# Altium schematic sheet FrontPanel.SchDoc: Front Panel
size 420 x 297 mm; CheckedBy: T.Janicki; CompanyName: Creotech Instruments SA; DrawnBy: G.Kasprowicz; Organization: CERN; Address1: European Organization for Nuclear Research; Address2: CH-1211 Genève 23 - Switzerland; Revision: -; SheetNumber: 9; SheetTotal: 15; EDA_Number: EDA-xxxx; Projet: Simple VME FMC Carrier; ModifiedBy: -; CreateDate: 20/11/2012; CheckedDate: 23/01/2012; DivGrp: BE-CO; Designer: G.Kasprowicz; PageSetup: Record=PageOptions|CenterHorizontal=True|CenterVertical=True|PrintScale=0.67|XCorrection=1.00|YCorrection=1.00|PrintKind=1|BorderSize=5000000|LeftOffset=0|BottomOffset=0|Orientation=2|PaperLength=1000|PaperWidth=1000|Scale=100|PaperSource=15|PrintQuality=600|MediaType=1|DitherType=10|PaperKind=A3|PrintScaleMode=1; ModifiedDate: -
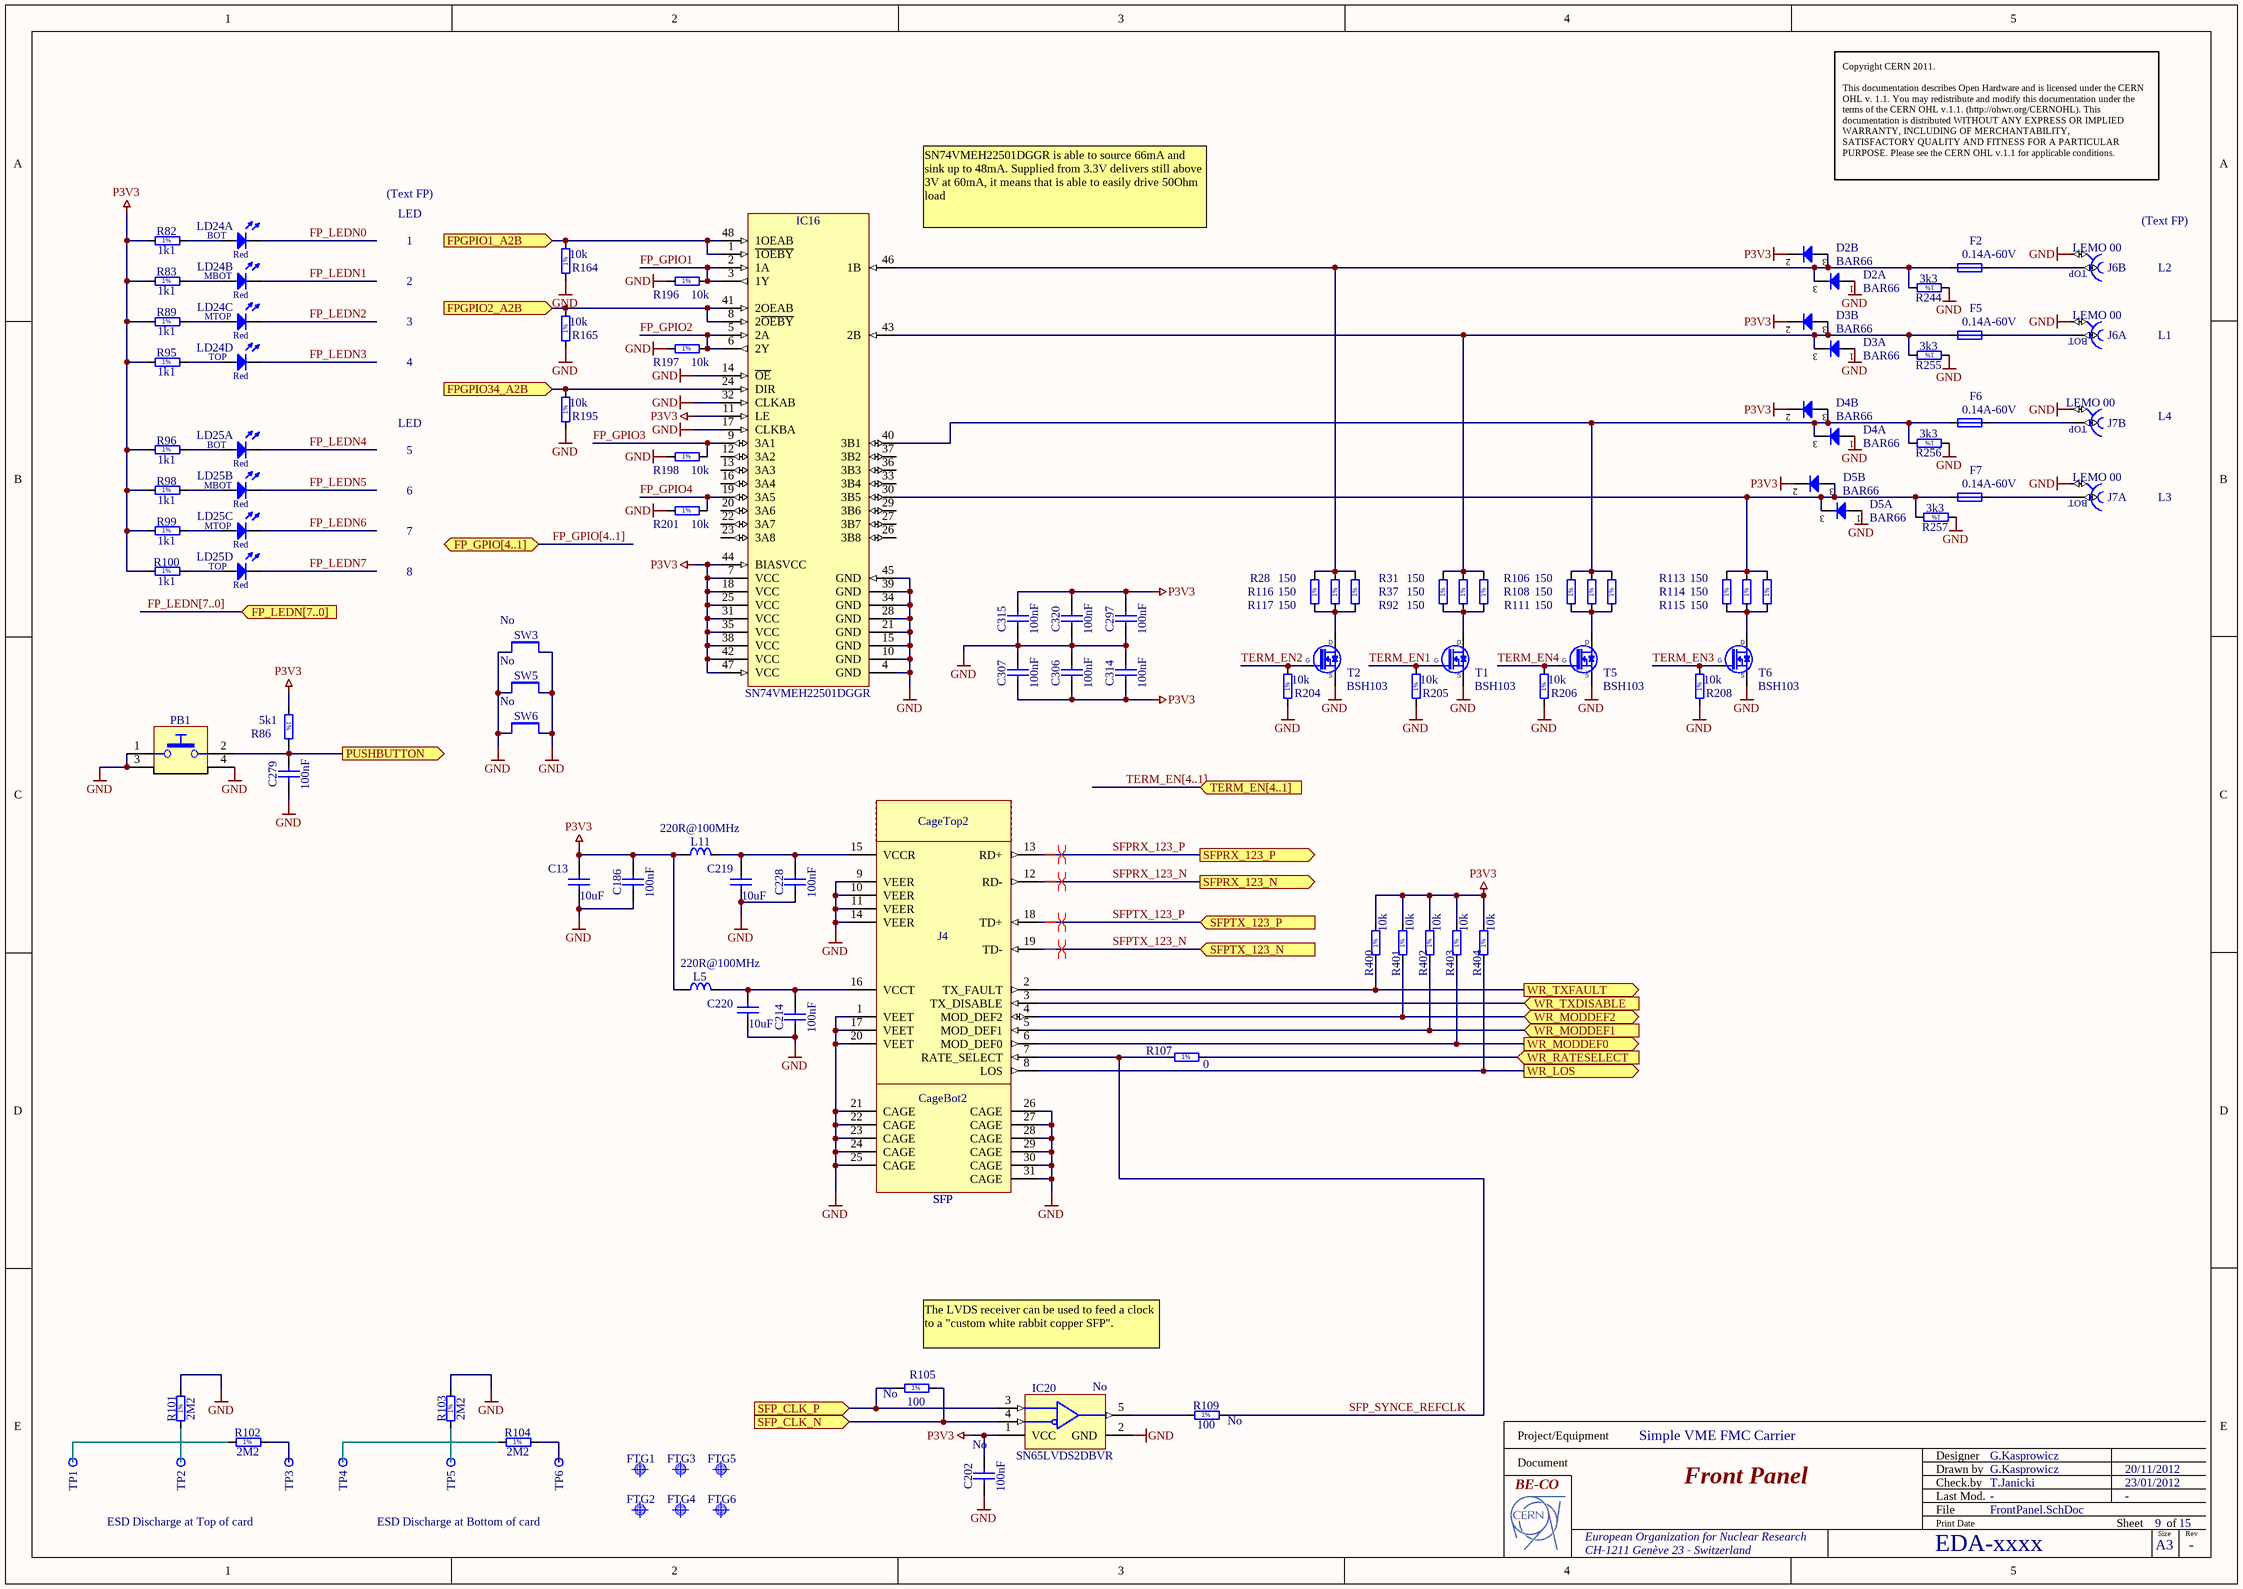
[diagram p0: FrontPanel.SchDoc]

## Parts
C13  10uF  [CAPC3225X270N]
C186  100nF  [CAPC1005X55N]
C202  100nF  Mounted: No  [CAPC1005X55N]
C214  100nF  [CAPC1005X55N]
C219  10uF  [CAPC3225X270N]
C220  10uF  [CAPC3225X270N]
C228  100nF  [CAPC1005X55N]
C279  100nF  [CAPC1005X55N]
C297  100nF  [CAPC1005X55N]
C306  100nF  [CAPC1005X55N]
C307  100nF  [CAPC1005X55N]
C314  100nF  [CAPC1005X55N]
C315  100nF  [CAPC1005X55N]
C320  100nF  [CAPC1005X55N]
CageBot2  SFP  [TYCO_6367034-1]
CageTop2  SFP  [TYCO_6367035-1]
D2  BAR66  [SOT95P240X110-3N]  (parts A,B of 2)
D3  BAR66  [SOT95P240X110-3N]  (parts A,B of 2)
D4  BAR66  [SOT95P240X110-3N]  (parts A,B of 2)
D5  BAR66  [SOT95P240X110-3N]  (parts A,B of 2)
F2  0.14A-60V  [FUSRC4632X90N]
F5  0.14A-60V  [FUSRC4632X90N]
F6  0.14A-60V  [FUSRC4632X90N]
F7  0.14A-60V  [FUSRC4632X90N]
FTG1  Use only in PCB  [FIDUCIAL_TOP_S100-200]  (value not drawn)
FTG2  Use only in PCB  [FIDUCIAL_TOP_S100-200]  (value not drawn)
FTG3  Use only in PCB  [FIDUCIAL_TOP_S100-200]  (value not drawn)
FTG4  Use only in PCB  [FIDUCIAL_TOP_S100-200]  (value not drawn)
FTG5  Use only in PCB  [FIDUCIAL_TOP_S100-200]  (value not drawn)
FTG6  Use only in PCB  [FIDUCIAL_TOP_S100-200]  (value not drawn)
IC16  SN74VMEH22501DGGR  [SOP50P810X120-48N]
IC20  SN65LVDS2DBVR  Mounted: No  [SOT95P280X145-5N]
J4  SFP  [TYCO_1367073-1]
J6  LEMO 00  [LEMO_EPY.00.250.NTNY]  (parts A,B of 2)
J7  LEMO 00  [LEMO_EPY.00.250.NTNY]  (parts A,B of 2)
L5  220R@100MHz  [INDC2012X105N]
L11  220R@100MHz  [INDC2012X105N]
LD24  HE Red  [LED_BIVAR_H485CHDL]  (value not drawn)  (parts A,B,C,D of 4)
LD25  HE Red  [LED_BIVAR_H485CHDL]  (value not drawn)  (parts A,B,C,D of 4)
PB1  Push Button  [PB_ALPS_SKHHLQA010]  (value not drawn)
R28  150  [RESC3216X65N]
R31  150  [RESC3216X65N]
R37  150  [RESC3216X65N]
R82  1k1  [RESC1608X55N]
R83  1k1  [RESC1608X55N]
R86  5k1  [RESC1608X55N]
R89  1k1  [RESC1608X55N]
R92  150  [RESC3216X65N]
R95  1k1  [RESC1608X55N]
R96  1k1  [RESC1608X55N]
R98  1k1  [RESC1608X55N]
R99  1k1  [RESC1608X55N]
R100  1k1  [RESC1608X55N]
R101  2M2  [RESC2012X60N]
R102  2M2  [RESC2012X60N]
R103  2M2  [RESC2012X60N]
R104  2M2  [RESC2012X60N]
R105  100  Mounted: No  [RESC1608X55N]
R106  150  [RESC3216X65N]
R107  0  [RESC1608X55N]
R108  150  [RESC3216X65N]
R109  100  Mounted: No  [RESC1608X55N]
R111  150  [RESC3216X65N]
R113  150  [RESC3216X65N]
R114  150  [RESC3216X65N]
R115  150  [RESC3216X65N]
R116  150  [RESC3216X65N]
R117  150  [RESC3216X65N]
R164  10k  [RESC1608X55N]
R165  10k  [RESC1608X55N]
R195  10k  [RESC1608X55N]
R196  10k  [RESC1608X55N]
R197  10k  [RESC1608X55N]
R198  10k  [RESC1608X55N]
R201  10k  [RESC1608X55N]
R204  10k  [RESC1608X55N]
R205  10k  [RESC1608X55N]
R206  10k  [RESC1608X55N]
R208  10k  [RESC1608X55N]
R244  3k3  [RESC1608X55N]
R255  3k3  [RESC1608X55N]
R256  3k3  [RESC1608X55N]
R257  3k3  [RESC1608X55N]
R400  10k  [RESC1608X55N]
R401  10k  [RESC1608X55N]
R402  10k  [RESC1608X55N]
R403  10k  [RESC1608X55N]
R404  10k  [RESC1608X55N]
SW3  Mounted: No  [COMATEL_313.0004.0.00.500]  (hidden comment: Jumper Type2)
SW5  Mounted: No  [COMATEL_313.0004.0.00.500]  (hidden comment: Jumper Type2)
SW6  Mounted: No  [COMATEL_313.0004.0.00.500]  (hidden comment: Jumper Type2)
T1  BSH103  [SOT95P230X110-3N]
T2  BSH103  [SOT95P230X110-3N]
T5  BSH103  [SOT95P230X110-3N]
T6  BSH103  [SOT95P230X110-3N]
TP1  Test Point  [TPS127]  (value not drawn)
TP2  Test Point  [TPS127]  (value not drawn)
TP3  Test Point  [TPS127]  (value not drawn)
TP4  Test Point  [TPS127]  (value not drawn)
TP5  Test Point  [TPS127]  (value not drawn)
TP6  Test Point  [TPS127]  (value not drawn)

## Ports
FP_GPIO[4..1] (bidir), FP_LEDN[7..0] (in), FPGPIO1_A2B (in), FPGPIO2_A2B (in), FPGPIO34_A2B (in), PUSHBUTTON (out), SFP_CLK_N (in), SFP_CLK_P (in), SFPRX_123_N (out), SFPRX_123_P (out), SFPTX_123_N (in), SFPTX_123_P (in), TERM_EN[4..1] (in), WR_LOS (out), WR_MODDEF0 (out), WR_MODDEF1 (in), WR_MODDEF2 (bidir), WR_RATESELECT (in), WR_TXDISABLE (in), WR_TXFAULT (out)

## Nets
GND: C13.2 C186.2 C202.1 C214.2 C219.2 C220.2 C228.2 C279.1 C297.1 C306.2 C307.2 C314.2 C315.1 C320.1 CageBot2.21(CAGE) CageBot2.22(CAGE) CageBot2.23(CAGE) CageBot2.24(CAGE) CageBot2.25(CAGE) CageBot2.26(CAGE) CageBot2.27(CAGE) CageBot2.28(CAGE) CageBot2.29(CAGE) CageBot2.30(CAGE) CageBot2.31(CAGE) D2.1(A) D3.1(A) D4.1(A) D5.1(A) IC16.4(GND) IC16.10(GND) IC16.14(~{OE}) IC16.15(GND) IC16.17(CLKBA) IC16.21(GND) IC16.28(GND) IC16.32(CLKAB) IC16.34(GND) IC16.39(GND) IC16.45(GND) IC20.2(GND) J4.1(VEET) J4.9(VEER) J4.10(VEER) J4.11(VEER) J4.14(VEER) J4.17(VEET) J4.20(VEET) J6.3 J7.3 PB1.1 PB1.3 PB1.4 R101.2 R103.2 R164.1 R165.1 R195.1 R196.1 R197.1 R198.1 R201.1 R204.1 R205.1 R206.1 R208.1 R244.1 R255.1 R256.1 R257.1 SW3.1 SW3.2 SW5.1 SW5.2 SW6.1 SW6.2 T1.2(S) T2.2(S) T5.2(S) T6.2(S)
P3V3: C13.1 C186.1 C202.2 C297.2 C306.1 C307.1 C314.1 C315.2 C320.2 D2.2(C) D3.2(C) D4.2(C) D5.2(C) IC16.7(VCC) IC16.11(LE) IC16.18(VCC) IC16.25(VCC) IC16.31(VCC) IC16.35(VCC) IC16.38(VCC) IC16.42(VCC) IC16.44(BIASVCC) IC16.47(VCC) IC20.1(VCC) L5.1 L11.1 R82.1 R83.1 R86.1 R89.1 R95.1 R96.1 R98.1 R99.1 R100.1 R400.2 R401.2 R402.2 R403.2 R404.2
FP_GPIO1: IC16.2(1A) IC16.3(1Y) R196.2
FP_GPIO2: IC16.5(2A) IC16.6(2Y) R197.2
FP_GPIO3: IC16.9(3A1) R198.2
FP_GPIO4: IC16.19(3A5) R201.2
FP_LEDN0: LD24.1(C)
FP_LEDN1: LD24.3(C)
FP_LEDN2: LD24.5(C)
FP_LEDN3: LD24.7(C)
FP_LEDN4: LD25.1(C)
FP_LEDN5: LD25.3(C)
FP_LEDN6: LD25.5(C)
FP_LEDN7: LD25.7(C)
FPGPIO1_A2B: IC16.1(~{1OEBY}) IC16.48(1OEAB) R164.2 ; port FPGPIO1_A2B
FPGPIO2_A2B: IC16.8(2~{OEBY}) IC16.41(2OEAB) R165.2 ; port FPGPIO2_A2B
FPGPIO34_A2B: IC16.24(DIR) R195.2 ; port FPGPIO34_A2B
PUSHBUTTON: C279.2 PB1.2 R86.2 ; port PUSHBUTTON
SFP_CLK_N: IC20.4(B) R105.2 ; port SFP_CLK_N
SFP_CLK_P: IC20.3(A) R105.1 ; port SFP_CLK_P
SFP_SYNCE_REFCLK: J4.7(RATE_SELECT) R107.1 R109.2
SFPRX_123_N: J4.12(RD-) ; port SFPRX_123_N
SFPRX_123_P: J4.13(RD+) ; port SFPRX_123_P
SFPTX_123_N: J4.19(TD-) ; port SFPTX_123_N
SFPTX_123_P: J4.18(TD+) ; port SFPTX_123_P
TERM_EN1: R205.2 T1.1(G)
TERM_EN2: R204.2 T2.1(G)
TERM_EN3: R208.2 T6.1(G)
TERM_EN4: R206.2 T5.1(G)
WR_LOS: J4.8(LOS) R404.1 ; port WR_LOS
WR_MODDEF0: J4.6(MOD_DEF0) R403.1 ; port WR_MODDEF0
WR_MODDEF1: J4.5(MOD_DEF1) R402.1 ; port WR_MODDEF1
WR_MODDEF2: J4.4(MOD_DEF2) R401.1 ; port WR_MODDEF2
WR_RATESELECT: R107.2 ; port WR_RATESELECT
WR_TXDISABLE: J4.3(TX_DISABLE) ; port WR_TXDISABLE
WR_TXFAULT: J4.2(TX_FAULT) R400.1 ; port WR_TXFAULT
NetC214_1: C214.1 C220.1 J4.16(VCCT) L5.2
NetC219_1: C219.1 C228.1 J4.15(VCCR) L11.2
NetD2_3: D2.3(COMAC) F2.1 IC16.46(1B) R28.2 R116.2 R117.2 R244.2
NetD3_3: D3.3(COMAC) F5.1 IC16.43(2B) R31.2 R37.2 R92.2 R255.2
NetD4_3: D4.3(COMAC) F6.1 IC16.40(3B1) R106.2 R108.2 R111.2 R256.2
NetD5_3: D5.3(COMAC) F7.1 IC16.30(3B5) R113.2 R114.2 R115.2 R257.2
NetF2_2: F2.2 J6.2
NetF5_2: F5.2 J6.1
NetF6_2: F6.2 J7.2
NetF7_2: F7.2 J7.1
NetIC20_5: IC20.5(R) R109.1
NetLD24_2: LD24.2(A) R82.2
NetLD24_4: LD24.4(A) R83.2
NetLD24_6: LD24.6(A) R89.2
NetLD24_8: LD24.8(A) R95.2
NetLD25_2: LD25.2(A) R96.2
NetLD25_4: LD25.4(A) R98.2
NetLD25_6: LD25.6(A) R99.2
NetLD25_8: LD25.8(A) R100.2
NetR28_1: R28.1 R116.1 R117.1 T2.3(D)
NetR31_1: R31.1 R37.1 R92.1 T1.3(D)
NetR101_1: R101.1 TP2.1
NetR102_1: R102.1 TP1.1
NetR102_2: R102.2 TP3.1
NetR103_1: R103.1 TP5.1
NetR104_1: R104.1 TP4.1
NetR104_2: R104.2 TP6.1
NetR106_1: R106.1 R108.1 R111.1 T5.3(D)
NetR113_1: R113.1 R114.1 R115.1 T6.3(D)

Not connected (* = marked no-connect by the designer): IC16 12(3A2) 13(3A3) 16(3A4) 20(3A6) 22(3A7) 23(3A8) 26(3B8) 27(3B7) 29(3B6) 33(3B4) 36(3B3) 37(3B2)

## Buses and harness runs
bus FP_GPIO[4..1] = port FP_GPIO[4..1]
bus FP_LEDN[7..0] = port FP_LEDN[7..0]
bus TERM_EN[4..1] = port TERM_EN[4..1]

## Layout directives
differential pair: SFPRX_123_N, SFPRX_123_P, SFPTX_123_N, SFPTX_123_P

## Notes on the sheet
- (Text FP)
- Copyright CERN 2011.
  This documentation describes Open Hardware and is licensed under the CERN OHL v. 1.1. You may redistribute and modify this documentation under the terms of the CERN OHL v.1.1. (http://ohwr.org/CERNOHL). This documentation is distributed WITHOUT ANY EXPRESS OR IMPLIED WARRANTY, INCLUDING OF MERCHANTABILITY, SATISFACTORY QUALITY AND FITNESS FOR A PARTICULAR PURPOSE. Please see the CERN OHL v.1.1 for applicable conditions.
- LED
- 1
- SN74VMEH22501DGGR is able to source 66mA and sink up to 48mA. Supplied from 3.3V delivers still above 3V at 60mA, it means that is able to easily drive 50Ohm load
- (near J6) (Text FP)
- L2
- 2
- 3
- 4
- L1
- 5
- L4
- 6
- 7
- L3
- 8
- The LVDS receiver can be used to feed a clock to a "custom white rabbit copper SFP".
- ESD Discharge at Top of card
- ESD Discharge at Bottom of card
- Project/Equipment
- Document
- Designer
- Drawn by
- Check.by
- File
- Last Mod.
- Print Date
- Sheet
- Size
- A3
- of
- Rev
- (in symbol LED_BIVAR_H485CHDL, part A) BOT; Red
- (in symbol LED_BIVAR_H485CHDL, part B) MBOT; Red
- (in symbol LED_BIVAR_H485CHDL, part C) MTOP; Red
- (in symbol LED_BIVAR_H485CHDL, part D) TOP; Red
- (in symbol LEMO_EPY.00.250.NTNY, part A) BOT
- (in symbol LEMO_EPY.00.250.NTNY, part B) TOP
- (in symbol R0603_0R_JUMPER) 1%
- (in symbol R0603_1K1_1%_0.1W_100PPM) 1%
- (in symbol R0603_3K3_1%_0.1W_100PPM) 1%
- (in symbol R0603_5K1_1%_0.1W_100PPM) 1%
- (in symbol R0603_10K_1%_0.1W_100PPM) 1%
- (in symbol R0603_100R_1%_0.1W_100PPM) 1%
- (in symbol R0805_2M2_1%_0.125W_100PPM) 1%
- (in symbol R1206_150R_1%_0.25W_100PPM) 1%
- (in symbol TYCO_1367073-1) Add Cage Top Here; (Ex: TYCO_6367035-1); Add Cage Bottom Here; (Ex: TYCO_6367034-1)

## Library data of the parts
C13 C219 C220 = CC1210_10UF_25V_10%_X7R: Non-polarised capacitor; Part Description: SMD Multilayer Chip Ceramic Capacitor; Manufacturer: GENERIC; Manufacturer1 Part Number: C1210C106K3RAC; Voltage: 25V; TC: X7R; Tolerance: ±10%; Table: Capacitors SMD; Part Number: CC1210_10UF_25V_10%_X7R; Component Kind: Standard; Component Type: Standard; Pin Count: 2; Value: 10uF; Status: None; Manufacturer Part Number: CC1210_10UF_25V_10%_X7R; Case: 1210; Mounted: Yes; Socket: No; SMD: Yes; Manufacturer1 Example: KEMET; Manufacturer1 ComponentHeight: 2.7mm; HelpURL: \\cern.ch\dfs\Applications\Altium\Datasheets\CC1210_X7R_KEMET.pdf; Author: CERN DEM JLC; CreateDate: 5/5/2009; LatestRevisionDate: 4/1/2010
C186 C202 C214 C228 C279 C297 C306 C307 C314 C315 C320 = CC0402_100NF_16V_10%_X7R: Non-polarised capacitor; Part Description: SMD Multilayer Chip Ceramic Capacitor; Manufacturer: GENERIC; Manufacturer1 Part Number: 223878715649; Voltage: 16V; TC: X7R; Tolerance: ±10%; Table: Capacitors SMD; Part Number: CC0402_100NF_16V_10%_X7R; Component Kind: Standard; Component Type: Standard; Pin Count: 2; Value: 100nF; Status: Not Recommended; Manufacturer Part Number: CC0402_100NF_16V_10%_X7R; Case: 0402; Socket: No; SMD: Yes; Manufacturer1 Example: PHYCOMP; Manufacturer1 ComponentHeight: 0.55mm; HelpURL: \\cern.ch\dfs\Applications\Altium\Datasheets\CC0402_X7R_PHYCOMP.pdf; Author: CERN DEM JLC
  C186 C214 C228: Mounted: Yes; CreateDate: 12/3/2007; LatestRevisionDate: 12/3/2007
  C202: CreateDate: 2007-12-03; LatestRevisionDate: 2007-12-03
  C279 C297 C306 C307 C314 C315 C320: Mounted: Yes; CreateDate: 03/12/2007; LatestRevisionDate: 03/12/2007
CageBot2 = TYCO_6367034-1: SFP  Cage Bottom (Small Form-factor Pluggable); Part Description: Cage bottom For Single Port SFP  (Small Form-factor Pluggable); Manufacturer: TYCO ELECTRONICS; Table: TYCO; Part Number: TYCO_6367034-1; Component Kind: Standard; Component Type: Standard; Pin Count: 11; Family: SFP; Mounted: Yes; Socket: No; SMD: No; Status: None; Manufacturer Part Number: TYCO_6367034-1; ComponentHeight: 8.8mm; ComponentLink1URL: \\cern.ch\dfs\Applications\Altium\Datasheets\TYCO_SFP_Application.pdf; ComponentLink1Description: Application; ComponentLink2URL: \\cern.ch\dfs\Applications\Altium\Datasheets\Tyco_SFP_Specification.pdf; ComponentLink2Description: SFP Specification; HelpURL: \\cern.ch\dfs\Applications\Altium\Datasheets\TYCO_6367034-1.pdf; Author: CERN DEM JLC; CreateDate: 1/25/2010; LatestRevisionDate: 1/25/2010
CageTop2 = TYCO_6367035-1: SFP  Cage Top (Small Form-factor Pluggable); Part Description: Cage Top For Single Port SFP  (Small Form-factor Pluggable); Manufacturer: TYCO ELECTRONICS; Table: TYCO; Part Number: TYCO_6367035-1; Component Kind: Standard; Component Type: Standard; Pin Count: 0; Family: SFP; Mounted: Yes; Socket: No; SMD: No; Status: None; Manufacturer Part Number: TYCO_6367035-1; ComponentHeight: 10mm; ComponentLink1URL: \\cern.ch\dfs\Applications\Altium\Datasheets\TYCO_SFP_Application.pdf; ComponentLink1Description: Application; ComponentLink2URL: \\cern.ch\dfs\Applications\Altium\Datasheets\Tyco_SFP_Specification.pdf; ComponentLink2Description: SFP Specification; HelpURL: \\cern.ch\dfs\Applications\Altium\Datasheets\TYCO_6367035-1.pdf; Author: CERN DEM JLC; CreateDate: 1/25/2010; LatestRevisionDate: 1/25/2010
D2-D5 = BAR66: Serial Diode; Part Description: Silicon PIN Diode Array (Series Connected); Manufacturer: INFINEON; Voltage: 150V; Power: 250mA; Table: Diodes; Part Number: BAR66; Component Kind: Standard; Component Type: Standard; Device: BAR66; PackageDescription: SOT23 3-Leads, Pitch 0.95mm - Body 1.3x2.9mm, IPC Medium Density; Manufacturer Part Number: BAR66; Pin Count: 3; Mounted: Yes; Socket: No; SMD: Yes; ComponentHeight: 1.1mm; HelpURL: \\cern.ch\dfs\Applications\Altium\Datasheets\BAR66.pdf; Author: CERN DEM JLC; CreateDate: 1/18/2010; LatestRevisionDate: 10/5/2010
F2 F5-F7 = FUSR1812_TYCO-miniSMD0114F: Fuse; Part Description: PolySwitch® PTC Overcurrent Protection Device; Manufacturer: TYCO ELECTRONICS; Manufacturer Part Number: miniSMDC014F; Table: Fuses; Part Number: FUSR1812_TYCO-miniSMD0114F; Component Kind: Standard; Component Type: Standard; Pin Count: 2; PackageDescription: Chip Resettable Fuse, 2-Leads, Body 4.6x3.2mm, IPC Medium Density; Family: Fuses Resettable; Mounted: Yes; Socket: No; SMD: Yes; Value: 0.14A-60V; ComponentHeight: 0.89mm; HelpURL: \\cern.ch\dfs\Applications\Altium\Datasheets\FUSR_TYCO_MiniSMD0114F.pdf; Author: CERN DEM JLC; CreateDate: 7/2/2008; LatestRevisionDate: 3/17/2010
FTG1-FTG6 = FIDUCIAL_TARGET_S100-200: Fiducial Target; Part Description: Scare Fiducial Target, Top Layer, 1.0mm, Top Sloder 2.0mm, Keepout =2.0mm; Mounted: No; Table: Pads; Part Number: FIDUCIAL_TARGET_S100-200; Component Kind: Standard (No BOM); Component Type: Standard (No BOM); Pin Count: 1; Family: Fiducial; Socket: No; SMD: Yes; Status: None; ComponentHeight: 0mm; Author: CERN DEM JLC; CreateDate: 09/02/2010; LatestRevisionDate: 09/02/2010; PackageDescription: Scare Fiducial Target, Top Layer, 1.0mm, Top Sloder 2.0mm, Keepout =2.0mm
IC16 = SN74VMEH22501DGGR: 8-Bit Universal Bus Transceiver and Two 1-Bit Bus Transceivers with 3-State Outputs; Manufacturer: TEXAS INSTRUMENTS; Table: Standard Logic; Part Number: SN74VMEH22501DGGR; Component Kind: Standard; Component Type: Standard; Device: SN74VMEH22501DGGR; PackageDescription: SOP, 48-Leads, Body 12.6x6.2mm (max), Pitch 0.50mm, IPC Medium Density; Part Description: 8-Bit Universal Bus Transceiver and Two 1-Bit Bus Transceivers with 3-State Outputs; Manufacturer Part Number: SN74VMEH22501DGGR; Pin Count: 48; Case: TSSOP48; Mounted: Yes; Socket: No; SMD: Yes; ComponentHeight: 1.2mm; Author: CERN DEM JLC; HelpURL: \\cern.ch\dfs\Applications\Altium\Datasheets\SN74VMEH22501DGGR.pdf; CreateDate: 10/27/2009; LatestRevisionDate: 10/27/2009
IC20 = SN65LVDS2DBVR: High-Speed Differential Line Receiver; Manufacturer: TEXAS INSTRUMENTS; Table: Analog & Interface; Part Number: SN65LVDS2DBVR; Component Kind: Standard; Component Type: Standard; Device: SN65LVDS2DBVR; PackageDescription: SOT, 0.95mm pitch; 5 pin, 1.60mm W X 2.90mm L X 1.45mm H body, IPC Medium Density; Part Description: High-Speed Differential Line Receiver; Manufacturer Part Number: SN65LVDS2DBVR; Pin Count: 5; Case: SOT23-5; Socket: No; SMD: Yes; ComponentHeight: 1.45mm; Author: CERN DEM JLC; HelpURL: \\cern.ch\dfs\Applications\Altium\Datasheets\SN65LVDS2DBVR.pdf; CreateDate: 3/3/2011; LatestRevisionDate: 3/3/2011
J4 = TYCO_1367073-1: 20 Position SFP  Connector (Small Form-factor Pluggable); Part Description: 20 Position, Pitch 0.8mm SFP  Receptacle (Small Form-factor Pluggable); Manufacturer: TYCO ELECTRONICS; Table: TYCO; Part Number: TYCO_1367073-1; Component Kind: Standard; Component Type: Standard; Pin Count: 20; Family: SFP; Mounted: Yes; Socket: No; SMD: Yes; Status: None; Manufacturer Part Number: 1367073-1; ComponentHeight: 5.4mm; ComponentLink1URL: \\cern.ch\dfs\Applications\Altium\Datasheets\TYCO_SFP_Application.pdf; ComponentLink1Description: Application; ComponentLink2URL: \\cern.ch\dfs\Applications\Altium\Datasheets\Tyco_SFP_Specification.pdf; ComponentLink2Description: SFP Specification; HelpURL: \\cern.ch\dfs\Applications\Altium\Datasheets\TYCO_1367073-1.pdf; Author: CERN DEM JLC; CreateDate: 2010-01-25; LatestRevisionDate: 2010-01-25
J6 J7 = LEMO_EPY.00.250.NTNY: Dual Female Coax 1-2 Common Shield 3; Part Description: Size 00 ,Low Profile Dual 50 Ohms Coaxial Elbow Sockets (90°); SCEM: 09.46.11.188.8; Part Number: LEMO_EPY.00.250.NTNY; Component Kind: Standard; Component Type: Standard; Pin Count: 4; Family: LEMO 00; Mounted: Yes; Socket: No; SMD: No; Status: None; Manufacturer: LEMO; Manufacturer Part Number: EPY.00.250.NTNY; ComponentHeight: 13.7mm; HelpURL: \\cern.ch\dfs\Applications\Altium\Datasheets\LEMO_EPY.00.250.NTNY.pdf; Author: CERN DEM JLC; CreateDate: 02/07/2009; LatestRevisionDate: 11/08/2009; Table: LEMO
L5 L11 = IND0805_MURATA_BLM21PG221SN1D: Inductor; Part Description: SMD EMIFIL Suppression Chip Bead Ferrite; Manufacturer: MURATA; Power: 2A; Resistance: 0.05R; Tolerance: ±25%; Table: Inductors SMD; Part Number: IND0805_MURATA_BLM21PG221SN1D; Component Kind: Standard; Component Type: Standard; Pin Count: 2; Value: 220R@100MHz; Status: None; Manufacturer Part Number: BLM21PG221SN1D; Case: 0805; Mounted: Yes; Socket: No; SMD: Yes; ComponentHeight: 1.05mm; HelpURL: \\cern.ch\dfs\Applications\Altium\Datasheets\IND0402_MURATA_BLM21P.pdf; Author: CERN DEM JLC; CreateDate: 25/01/2010; LatestRevisionDate: 25/01/2010
LD24 LD25 = LED_BIVAR_H485CHDL: LED x4 Red 1C2A-BOT_3C4A_5C6A_7C8A-TOP; Part Description: Quad-Level 2mm HE Red, PCB Edge Mounting; Manufacturer: BIVAR; Table: LEDs & Displays; Part Number: LED_BIVAR_H485CHDL; Component Kind: Standard; Component Type: Standard; Color: HE Red; PackageDescription: Quad-Level 2mm HE Red, PCB Edge Mounting  BIVAR H485CHDL; Manufacturer Part Number: H485CHDL; Pin Count: 8; Mounted: Yes; Socket: No; SMD: No; ComponentHeight: 11.3mm; HelpURL: \\cern.ch\dfs\Applications\Altium\Datasheets\LED_BIVAR_H485CHDL.pdf; Author: CERN DEM JLC; CreateDate: 11/12/2008; LatestRevisionDate: 17/03/2010
PB1 = PB_ALPS_SKHHLQA010: Push-Button Switch SPDT; Part Description: 6x6mm, SPST Horizontal Pushbutton Switch, Stem height 8.35mm, Contact Rating 50mA 12VDC, Serie SKHH; Manufacturer: ALPS; Table: Switches; Part Number: PB_ALPS_SKHHLQA010; Component Kind: Standard; Component Type: Standard; Pin Count: 4; PackageDescription: Body 6x6mm, Stem height 8.35mm, Horizontal Pushbutton Switch, ALPS Serie SKHH; Family: Push Button; Mounted: Yes; Socket: No; SMD: No; Status: None; Manufacturer Part Number: SKHHLQA010; ComponentHeight: 7.4mm; HelpURL: \\cern.ch\dfs\Applications\Altium\Datasheets\PB_ALPS_SKHHLQA010.pdf; Author: CERN DEM JLC; CreateDate: 2009-01-15; LatestRevisionDate: 2009-01-15
R28 R31 R37 R92 R106 R108 R111 R113-R117 = R1206_150R_1%_0.25W_100PPM: Resistor - 1%; Part Description: General Purpose Thick Film Chip Resistor; Manufacturer: GENERIC; Manufacturer1 Part Number: NRC12F1500TRF; Power: 0.25W; TC: ±100ppm/°C; Table: Resistors SMD; Part Number: R1206_150R_1%_0.25W_100PPM; Component Kind: Standard; Component Type: Standard; Pin Count: 2; Value: 150; Status: Preferred; Tolerance: ±1%; Manufacturer Part Number: R1206_150R_1%_0.25W_100PPM; Case: 1206; Mounted: Yes; Socket: No; SMD: Yes; Manufacturer1 Example: NIC COMPONENT; Manufacturer1 ComponentHeight: 0.65mm; HelpURL: \\cern.ch\dfs\Applications\Altium\Datasheets\R1206_NIC_NRC.pdf; Author: CERN DEM JLC; CreateDate: 12/3/2007; LatestRevisionDate: 3/13/2008
R82 R83 R89 R95 R96 R98-R100 = R0603_1K1_1%_0.1W_100PPM: Resistor - 1%; Part Description: General Purpose Thick Film Chip Resistor; Manufacturer: GENERIC; Manufacturer1 Part Number: NRC06F1101TRF; Power: 0.1W; TC: ±100ppm/°C; Table: Resistors SMD; Part Number: R0603_1K1_1%_0.1W_100PPM; Component Kind: Standard; Component Type: Standard; Pin Count: 2; Value: 1k1; Status: Preferred; Tolerance: ±1%; Manufacturer Part Number: R0603_1K1_1%_0.1W_100PPM; Case: 0603; Mounted: Yes; Socket: No; SMD: Yes; Manufacturer1 Example: NIC COMPONENT; Manufacturer1 ComponentHeight: 0.55mm; HelpURL: \\cern.ch\dfs\Applications\Altium\Datasheets\R0603_NIC_NRC.pdf; Author: CERN DEM JLC; CreateDate: 2007-12-03; LatestRevisionDate: 2008-03-13
R86 = R0603_5K1_1%_0.1W_100PPM: Resistor - 1%; Part Description: General Purpose Thick Film Chip Resistor; Manufacturer: GENERIC; Manufacturer1 Part Number: NRC06F5101TRF; Power: 0.1W; TC: ±100ppm/°C; Table: Resistors SMD; Part Number: R0603_5K1_1%_0.1W_100PPM; Component Kind: Standard; Component Type: Standard; Pin Count: 2; Value: 5k1; Status: Preferred; Tolerance: ±1%; Manufacturer Part Number: R0603_5K1_1%_0.1W_100PPM; Case: 0603; Mounted: Yes; Socket: No; SMD: Yes; Manufacturer1 Example: NIC COMPONENT; Manufacturer1 ComponentHeight: 0.55mm; HelpURL: \\cern.ch\dfs\Applications\Altium\Datasheets\R0603_NIC_NRC.pdf; Author: CERN DEM JLC; CreateDate: 03/12/2007; LatestRevisionDate: 13/03/2008
R101-R104 = R0805_2M2_1%_0.125W_100PPM: Resistor - 1%; Part Description: General Purpose Thick Film Chip Resistor; Manufacturer: GENERIC; Manufacturer1 Part Number: NRC10F2204TRF; Manufacturer1 Datasheet: \\cern.ch\dfs\Applications\Altium\Datasheets\R0805_NIC_NRC.pdf; Power: 0.125W; TC: ±100ppm/°C; Table: Resistors SMD; Part Number: R0805_2M2_1%_0.125W_100PPM; Component Kind: Standard; Component Type: Standard; Designator: Resistor - 1%; Library Reference: Resistor - 1%; Pin Count: 2; Value: 2M2; Status: Preferred; Tolerance: ±1%; Manufacturer Part Number: R0805_2M2_1%_0.125W_100PPM; Case: 0805; Mounted: Yes; Socket: No; SMD: Yes; Manufacturer1 Example: NIC COMPONENT; Manufacturer1 ComponentHeight: 0.6mm; HelpURL: \\cern.ch\dfs\Applications\Altium\Datasheets\R0805_NIC_NRC.pdf; Author: CERN DEM JLC; CreateDate: 03/12/2007; LatestRevisionDate: 13/03/2008
R105 R109 = R0603_100R_1%_0.1W_100PPM: Resistor - 1%; Part Description: General Purpose Thick Film Chip Resistor; Manufacturer: GENERIC; Manufacturer1 Part Number: NRC06F4700TRF; Power: 0.1W; TC: ±100ppm/°C; Table: Resistors SMD; Part Number: R0603_100R_1%_0.1W_100PPM; Component Kind: Standard; Component Type: Standard; Pin Count: 2; Value: 100; Status: Preferred; Tolerance: ±1%; Manufacturer Part Number: R0603_100R_1%_0.1W_100PPM; Case: 0603; Socket: No; SMD: Yes; Manufacturer1 Example: NIC COMPONENT; Manufacturer1 ComponentHeight: 0.55mm; HelpURL: \\cern.ch\dfs\Applications\Altium\Datasheets\R0603_NIC_NRC.pdf; Author: CERN DEM JLC; CreateDate: 12/3/2007; LatestRevisionDate: 3/13/2008
R107 = R0603_0R_JUMPER: Resistor - 1%; Part Description: 1A (0.05R Max DC Resistance) Zero Ohm Jumper; Manufacturer: GENERIC; Manufacturer1 Part Number: NRC06Z0; Table: Resistors SMD; Part Number: R0603_0R_JUMPER; Component Kind: Standard; Component Type: Standard; Pin Count: 2; Value: 0; Status: Preferred; Manufacturer Part Number: R0603_0R_JUMPER; Case: 0603; Mounted: Yes; Socket: No; SMD: Yes; Manufacturer1 Example: NIC COMPONENT; Manufacturer1 ComponentHeight: 0.55mm; HelpURL: \\cern.ch\dfs\Applications\Altium\Datasheets\R0603_NIC_NRC.pdf; Author: CERN DEM JLC; CreateDate: 12/3/2007; LatestRevisionDate: 3/13/2008
R164 R165 R195-R198 R201 R204-R206 R208 R400-R404 = R0603_10K_1%_0.1W_100PPM: Resistor - 1%; Part Description: General Purpose Thick Film Chip Resistor; Manufacturer: GENERIC; Manufacturer1 Part Number: NRC06F1002TRF; Power: 0.1W; TC: ±100ppm/°C; Table: Resistors SMD; Part Number: R0603_10K_1%_0.1W_100PPM; Component Kind: Standard; Component Type: Standard; Pin Count: 2; Value: 10k; Status: Preferred; Tolerance: ±1%; Manufacturer Part Number: R0603_10K_1%_0.1W_100PPM; Case: 0603; Mounted: Yes; Socket: No; SMD: Yes; Manufacturer1 Example: NIC COMPONENT; Manufacturer1 ComponentHeight: 0.55mm; HelpURL: \\cern.ch\dfs\Applications\Altium\Datasheets\R0603_NIC_NRC.pdf; Author: CERN DEM JLC; CreateDate: 12/3/2007; LatestRevisionDate: 3/13/2008
R244 R255-R257 = R0603_3K3_1%_0.1W_100PPM: Resistor - 1%; Part Description: General Purpose Thick Film Chip Resistor; Manufacturer: GENERIC; Manufacturer1 Part Number: NRC06F3301TRF; Power: 0.1W; TC: ±100ppm/°C; Table: Resistors SMD; Part Number: R0603_3K3_1%_0.1W_100PPM; Component Kind: Standard; Component Type: Standard; Pin Count: 2; Value: 3k3; Status: Preferred; Tolerance: ±1%; Manufacturer Part Number: R0603_3K3_1%_0.1W_100PPM; Case: 0603; Mounted: Yes; Socket: No; SMD: Yes; Manufacturer1 Example: NIC COMPONENT; Manufacturer1 ComponentHeight: 0.55mm; HelpURL: \\cern.ch\dfs\Applications\Altium\Datasheets\R0603_NIC_NRC.pdf; Author: CERN DEM JLC; CreateDate: 2007-12-03; LatestRevisionDate: 2008-03-13
SW3 SW5 SW6 = COMATEL_313.0004.0.00.500: Jumper 2 pins; Part Description: Male Jumper Pitch 10.16mm; Manufacturer: KONTEK COMATEL; SCEM: 07.88.24.516.1; Part Number: COMATEL_313.0004.0.00.500; Component Kind: Standard; Component Type: Standard; Pin Count: 2; Family: Jumper 10.16mm; Socket: No; SMD: No; Status: None; Manufacturer Part Number: 313.0004.0.00.500; ComponentHeight: 2mm; HelpURL: \\cern.ch\dfs\Applications\Altium\Datasheets\COMATEL_313.0004.0.00.500.pdf; Author: CERN DEM JMW; CreateDate: 29/09/2008; LatestRevisionDate: 29/09/2008; Table: COMATEL
T1 T2 T5 T6 = BSH103: N-CHANNEL MOSFET WITH DIODE; Part Description: 50V 200mA N-Channel Enhancement Mode Field-Effect Transistor; Manufacturer: NXP SEMICONDUCTORS; Table: Transistors; Part Number: BSH103; Component Kind: Standard; Component Type: Standard; Device: BSH103; PackageDescription: SOT23, 3 pin, Pitch 0.95mm - 1.3mm W X 2.9mm L X 1.1mm H, IPC Medium Density; Manufacturer Part Number: BSH103; Pin Count: 3; Case: SOT23-3; Mounted: Yes; Socket: No; SMD: Yes; ComponentHeight: 1.1mm; HelpURL: \\cern.ch\dfs\Applications\Altium\Datasheets\BSH103.pdf; Author: CERN DEM JLC; CreateDate: 3/16/2010; LatestRevisionDate: 3/16/2010
TP1-TP6 = SMD_PAD_1.27X1.27MM: Part Description: 1.27mm x 1.27mm PCB Copper Area (SMD Test Point); Mounted: No; Table: Pads; Part Number: SMD_PAD_1.27X1.27MM; Component Kind: Standard (No BOM); Component Type: Standard (No BOM); Designator: Test Point; Library Reference: Test Point; Pin Count: 1; Family: Test Point; Socket: No; SMD: Yes; Status: None; ComponentHeight: 0mm; Author: CERN DEM JLC; CreateDate: 12/01/2008; LatestRevisionDate: 12/01/2008; PackageDescription: 1.27mm x 1.27mm PCB Copper Area (SMD Test Point)